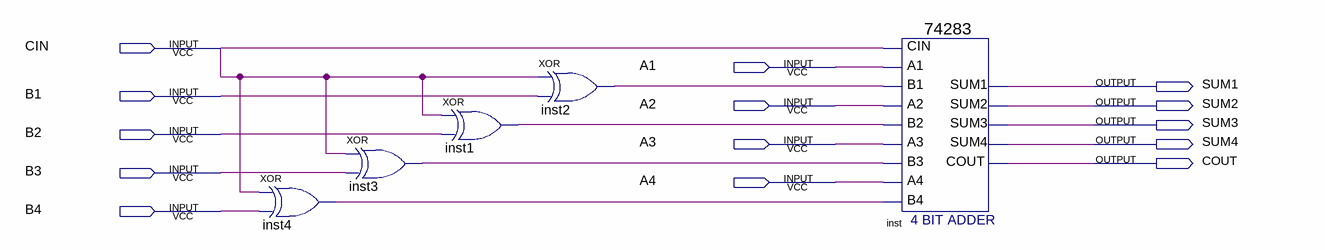
[diagram p0: schematic sheet]
// Quartus schematic Ex6_Full.bdf as structural Verilog: 5 symbols, 14 pins
module Ex6_Full (
  input  CIN,
  input  A1,
  input  B1,
  input  A2,
  input  B2,
  input  A3,
  input  B3,
  input  A4,
  input  B4,
  output SUM1,
  output SUM2,
  output SUM3,
  output SUM4,
  output COUT
);

  wire inst1_out, inst2_out, inst3_out, inst4_out;

  xor inst4 (inst4_out, CIN, B4);
  xor inst3 (inst3_out, CIN, B3);
  xor inst1 (inst1_out, CIN, B2);
  xor inst2 (inst2_out, CIN, B1);
  \74283  inst (
    .CIN(CIN), .A1(A1), .A2(A2), .B2(inst1_out), .A3(A3), .A4(A4), .B4(inst4_out), .B1(inst2_out),
    .B3(inst3_out), .SUM4(SUM4), .COUT(COUT), .SUM1(SUM1), .SUM2(SUM2), .SUM3(SUM3));
endmodule
